# Altium schematic sheet Led.SchDoc
size A
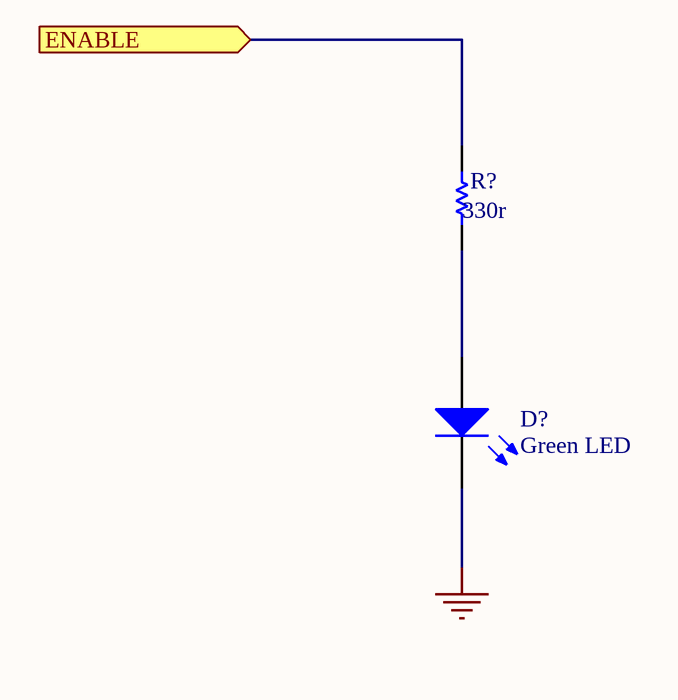
[diagram p0: Led.SchDoc]

## Parts
D?  Green LED  [LED-0]
R?  value 330r  [AXIAL-0.3]  (hidden comment: Res1)

## Ports
ENABLE (in)

## Nets
GND: D?.2(K)
ENABLE: R?.2 ; port ENABLE
NetD?_1: D?.1(A) R?.1

## Library data of the parts
D? = LED0: Typical INFRARED GaAs LED; Published: 8-Jun-2000; LatestRevisionDate: 08-Jul-2005; LatestRevisionNote: Mech Layer 1 removed.; PackageReference: LED-0; Publisher: Altium Limited; PackageDescription: LED; 2 Leads
R? = Res1: Resistor; Published: 8-Jun-2000; LatestRevisionDate: 17-Jul-2002; LatestRevisionNote: Re-released for DXP Platform.; PackageReference: AXIAL-0.3; Publisher: Altium Limited; PackageDescription: Axial Device, Thru-Hole; 2 Leads; 0.3 in Pin Spacing